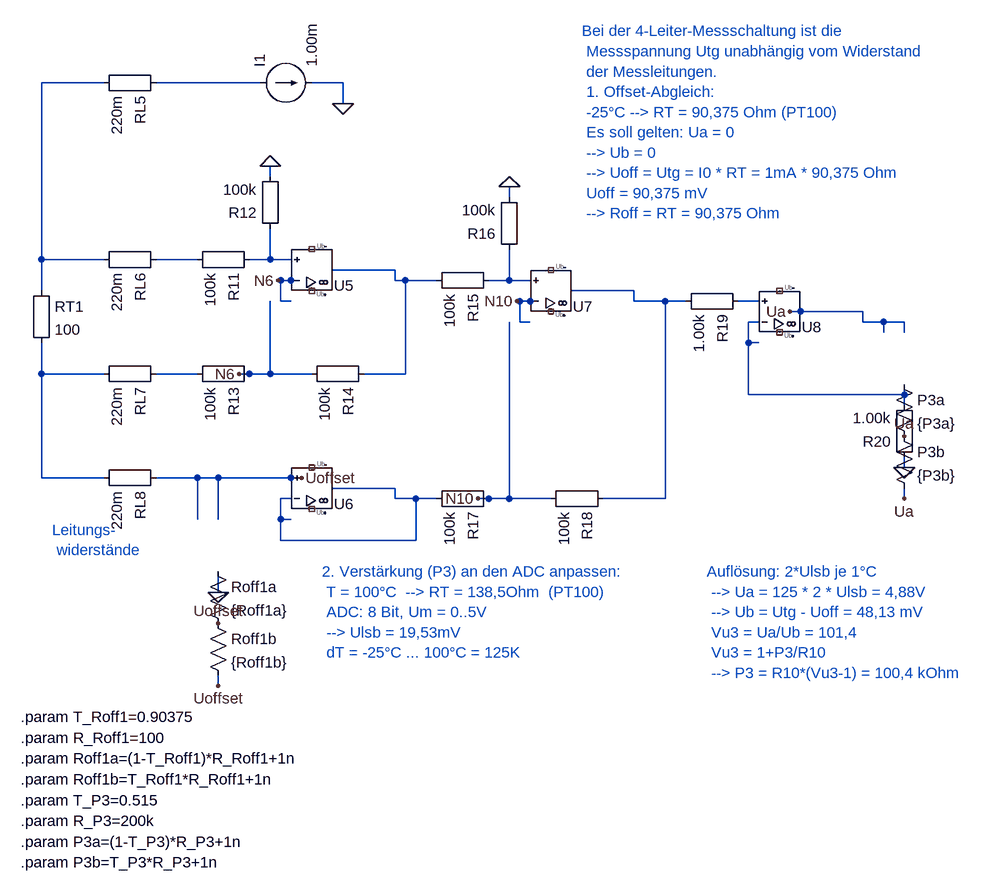
[diagram p0: schematic 1_5_4_PT100_Sensor_4-Leiter-Schaltung.asc]
1_5_4_PT100_Sensor_4-Leiter-Schaltung.asc, the LTspice schematic file:
Version 4
SHEET 1 880 680
WIRE 480 448 464 448
WIRE 464 448 464 480
WIRE 464 480 480 480
WIRE 544 432 640 432
WIRE 640 432 640 448
WIRE 480 784 464 784
WIRE 464 784 464 816
WIRE 464 816 480 816
WIRE 544 768 640 768
WIRE 640 768 640 784
WIRE 848 480 832 480
WIRE 832 480 832 512
WIRE 832 512 848 512
WIRE 912 464 1008 464
WIRE 1008 464 1008 480
WIRE 1200 512 1184 512
WIRE 1184 512 1184 544
WIRE 1184 544 1200 544
WIRE 1264 496 1360 496
WIRE 1360 496 1360 512
WIRE 512 144 528 144
WIRE 560 176 560 144
WIRE 560 144 528 144
WIRE 448 272 448 288
WIRE 272 416 336 416
WIRE 272 144 432 144
WIRE 192 144 96 144
WIRE 96 144 96 416
WIRE 96 544 96 592
WIRE 96 416 96 464
WIRE 192 416 96 416
WIRE 96 592 96 752
WIRE 96 752 192 752
WIRE 192 592 96 592
WIRE 416 416 448 416
WIRE 448 416 480 416
WIRE 448 368 448 416
WIRE 448 480 448 592
WIRE 448 592 416 592
WIRE 512 592 448 592
WIRE 336 592 272 592
WIRE 704 448 656 448
WIRE 784 448 816 448
WIRE 816 320 816 304
WIRE 816 448 848 448
WIRE 816 400 816 448
WIRE 816 512 816 784
WIRE 816 784 784 784
WIRE 880 784 816 784
WIRE 704 784 672 784
WIRE 672 784 640 784
WIRE 464 816 464 848
WIRE 464 848 672 848
WIRE 672 848 672 784
WIRE 480 752 368 752
WIRE 368 928 368 896
WIRE 368 752 336 752
WIRE 368 816 368 752
WIRE 336 752 272 752
WIRE 336 816 336 752
WIRE 656 448 640 448
WIRE 592 592 656 592
WIRE 656 592 656 448
WIRE 960 784 1056 784
WIRE 1056 784 1056 480
WIRE 1168 480 1200 480
WIRE 1056 480 1008 480
WIRE 1088 480 1056 480
WIRE 1360 512 1392 512
WIRE 1392 512 1424 512
WIRE 1424 512 1424 528
WIRE 1392 528 1392 512
WIRE 1424 736 1424 720
WIRE 1424 640 1424 624
WIRE 1424 624 1424 608
WIRE 1184 544 1184 624
WIRE 1184 624 1424 624
WIRE 480 448 460 448
WIRE 416 592 400 592
WIRE 848 480 828 480
WIRE 784 784 768 784
WIRE 1264 496 1248 496
WIRE 1424 768 1424 784
WIRE 480 752 496 752
WIRE 368 1056 368 1072
FLAG 560 176 0
FLAG 448 272 0
FLAG 816 304 0
FLAG 368 928 0
FLAG 1424 736 0
FLAG 560 176 0
FLAG 448 272 0
FLAG 816 304 0
FLAG 368 928 0
FLAG 1424 736 0
FLAG 460 448 N6
FLAG 400 592 N6
FLAG 828 480 N10
FLAG 768 784 N10
FLAG 1248 496 Ua
FLAG 1424 784 Ua
FLAG 1424 688 Ua
FLAG 496 752 Uoffset
FLAG 368 1072 Uoffset
FLAG 368 976 Uoffset
SYMBOL UniversalOpAmp2 512 432 M180
SYMATTR InstName U5
SYMATTR Value UniversalOpAmp2
SYMBOL UniversalOpAmp2 512 768 M180
SYMATTR InstName U6
SYMATTR Value UniversalOpAmp2
SYMBOL UniversalOpAmp2 880 464 M180
SYMATTR InstName U7
SYMATTR Value UniversalOpAmp2
SYMBOL UniversalOpAmp2 1232 496 M180
SYMATTR InstName U8
SYMATTR Value UniversalOpAmp2
SYMBOL current 432 144 R270
SYMATTR InstName I1
SYMATTR Value 1.00m
SYMBOL Misc\EuropeanResistor 80 448 R0
SYMATTR InstName RT1
SYMATTR Value 100
SYMBOL Misc\EuropeanResistor 288 128 R90
SYMATTR InstName RL5
SYMATTR Value 220m
SYMBOL Misc\EuropeanResistor 288 400 R90
SYMATTR InstName RL6
SYMATTR Value 220m
SYMBOL Misc\EuropeanResistor 288 576 R90
SYMATTR InstName RL7
SYMATTR Value 220m
SYMBOL Misc\EuropeanResistor 288 736 R90
SYMATTR InstName RL8
SYMATTR Value 220m
SYMBOL Misc\EuropeanResistor 432 400 R90
SYMATTR InstName R11
SYMATTR Value 100k
SYMBOL Misc\EuropeanResistor 464 384 R180
SYMATTR InstName R12
SYMATTR Value 100k
SYMBOL Misc\EuropeanResistor 432 576 R90
SYMATTR InstName R13
SYMATTR Value 100k
SYMBOL Misc\EuropeanResistor 608 576 R90
SYMATTR InstName R14
SYMATTR Value 100k
SYMBOL Misc\EuropeanResistor 800 432 R90
SYMATTR InstName R15
SYMATTR Value 100k
SYMBOL Misc\EuropeanResistor 832 416 R180
SYMATTR InstName R16
SYMATTR Value 100k
SYMBOL Misc\EuropeanResistor 800 768 R90
SYMATTR InstName R17
SYMATTR Value 100k
SYMBOL Misc\EuropeanResistor 976 768 R90
SYMATTR InstName R18
SYMATTR Value 100k
SYMBOL res 352 880 R0
SYMATTR InstName Roff1a
SYMATTR Value {Roff1a}
SYMBOL res 352 960 R0
SYMATTR InstName Roff1b
SYMATTR Value {Roff1b}
SYMBOL Misc\EuropeanResistor 1184 464 R90
SYMATTR InstName R19
SYMATTR Value 1.00k
SYMBOL res 1408 592 R0
SYMATTR InstName P3a
SYMATTR Value {P3a}
SYMBOL res 1408 672 R0
SYMATTR InstName P3b
SYMATTR Value {P3b}
SYMBOL Misc\EuropeanResistor 1440 736 R180
SYMATTR InstName R20
SYMATTR Value 1.00k
TEXT 64 1120 Left 2 !.param T_Roff1=0.90375
TEXT 64 1152 Left 2 !.param R_Roff1=100
TEXT 64 1184 Left 2 !.param Roff1a=(1-T_Roff1)*R_Roff1+1n
TEXT 64 1216 Left 2 !.param Roff1b=T_Roff1*R_Roff1+1n
TEXT 64 1248 Left 2 !.param T_P3=0.515
TEXT 64 1280 Left 2 !.param R_P3=200k
TEXT 64 1312 Left 2 !.param P3a=(1-T_P3)*R_P3+1n
TEXT 64 1344 Left 2 !.param P3b=T_P3*R_P3+1n
TEXT 928 64 Left 2 ;Bei der 4-Leiter-Messschaltung ist die \n Messspannung Utg unabhängig vom Widerstand \n der Messleitungen. \n 1. Offset-Abgleich: \n -25°C --> RT = 90,375 Ohm (PT100) \n Es soll gelten: Ua = 0 \n --> Ub = 0 \n --> Uoff = Utg = I0 * RT = 1mA * 90,375 Ohm \n Uoff = 90,375 mV \n --> Roff = RT = 90,375 Ohm
TEXT 528 896 Left 2 ;2. Verstärkung (P3) an den ADC anpassen: \n T = 100°C  --> RT = 138,5Ohm  (PT100) \n ADC: 8 Bit, Um = 0..5V \n --> Ulsb = 19,53mV \n dT = -25°C ... 100°C = 125K
TEXT 1120 896 Left 2 ;Auflösung: 2*Ulsb je 1°C \n --> Ua = 125 * 2 * Ulsb = 4,88V \n --> Ub = Utg - Uoff = 48,13 mV \n Vu3 = Ua/Ub = 101,4 \n Vu3 = 1+P3/R10 \n --> P3 = R10*(Vu3-1) = 100,4 kOhm
TEXT 112 832 Left 2 ;Leitungs- \n widerstände

The netlist it stands for:
* 1_5_4_PT100_Sensor_4-Leiter-Schaltung.asc
XU5 N009 N6 NC_01 NC_02 N001 level2 UniversalOpAmp2 Avol=1Meg GBW=10Meg Slew=10Meg Ilimit=25m Rail=0 Vos=0 En=0 Enk=0 In=0 Ink=0 Rin=500Meg  ; pins In+ In- V+ V- OUT
XU6 Uoffset N002 NC_03 NC_04 N002 level2 UniversalOpAmp2 Avol=1Meg GBW=10Meg Slew=10Meg Ilimit=25m Rail=0 Vos=0 En=0 Enk=0 In=0 Ink=0 Rin=500Meg  ; pins In+ In- V+ V- OUT
XU7 N011 N10 NC_05 NC_06 N003 level2 UniversalOpAmp2 Avol=1Meg GBW=10Meg Slew=10Meg Ilimit=25m Rail=0 Vos=0 En=0 Enk=0 In=0 Ink=0 Rin=500Meg  ; pins In+ In- V+ V- OUT
XU8 N012 N004 NC_07 NC_08 Ua level2 UniversalOpAmp2 Avol=1Meg GBW=10Meg Slew=10Meg Ilimit=25m Rail=0 Vos=0 En=0 Enk=0 In=0 Ink=0 Rin=500Meg  ; pins In+ In- V+ V- OUT
I1 N006 0 1.00m
RT1 N007 N008 100
RL5 N006 N007 220m
RL6 N005 N007 220m
RL7 N010 N008 220m
RL8 Uoffset N008 220m
R11 N009 N005 100k
R12 N009 0 100k
R13 N6 N010 100k
R14 N001 N6 100k
R15 N011 N001 100k
R16 N011 0 100k
R17 N10 N002 100k
R18 N003 N10 100k
Roff1a 0 Uoffset {Roff1a}
Roff1b Uoffset Uoffset {Roff1b}
R19 N012 N003 1.00k
R§P3a N004 Ua {P3a}
R§P3b Ua Ua {P3b}
R20 0 N004 1.00k
.param T_Roff1=0.90375
.param R_Roff1=100
.param Roff1a=(1-T_Roff1)*R_Roff1+1n
.param Roff1b=T_Roff1*R_Roff1+1n
.param T_P3=0.515
.param R_P3=200k
.param P3a=(1-T_P3)*R_P3+1n
.param P3b=T_P3*R_P3+1n
* Bei der 4-Leiter-Messschaltung ist die
*  Messspannung Utg unabhängig vom Widerstand
*  der Messleitungen.
*  1. Offset-Abgleich:
*  -25°C --> RT = 90,375 Ohm (PT100)
*  Es soll gelten: Ua = 0
*  --> Ub = 0
*  --> Uoff = Utg = I0 * RT = 1mA * 90,375 Ohm
*  Uoff = 90,375 mV
*  --> Roff = RT = 90,375 Ohm
* 2. Verstärkung (P3) an den ADC anpassen:
*  T = 100°C  --> RT = 138,5Ohm  (PT100)
*  ADC: 8 Bit, Um = 0..5V
*  --> Ulsb = 19,53mV
*  dT = -25°C ... 100°C = 125K
* Auflösung: 2*Ulsb je 1°C
*  --> Ua = 125 * 2 * Ulsb = 4,88V
*  --> Ub = Utg - Uoff = 48,13 mV
*  Vu3 = Ua/Ub = 101,4
*  Vu3 = 1+P3/R10
*  --> P3 = R10*(Vu3-1) = 100,4 kOhm
* Leitungs-
*  widerstände
.lib UniversalOpAmp2.lib
.backanno
.end